# Altium project SAMA7D65-Curiosity.PrjPcb (part 12 of 12)
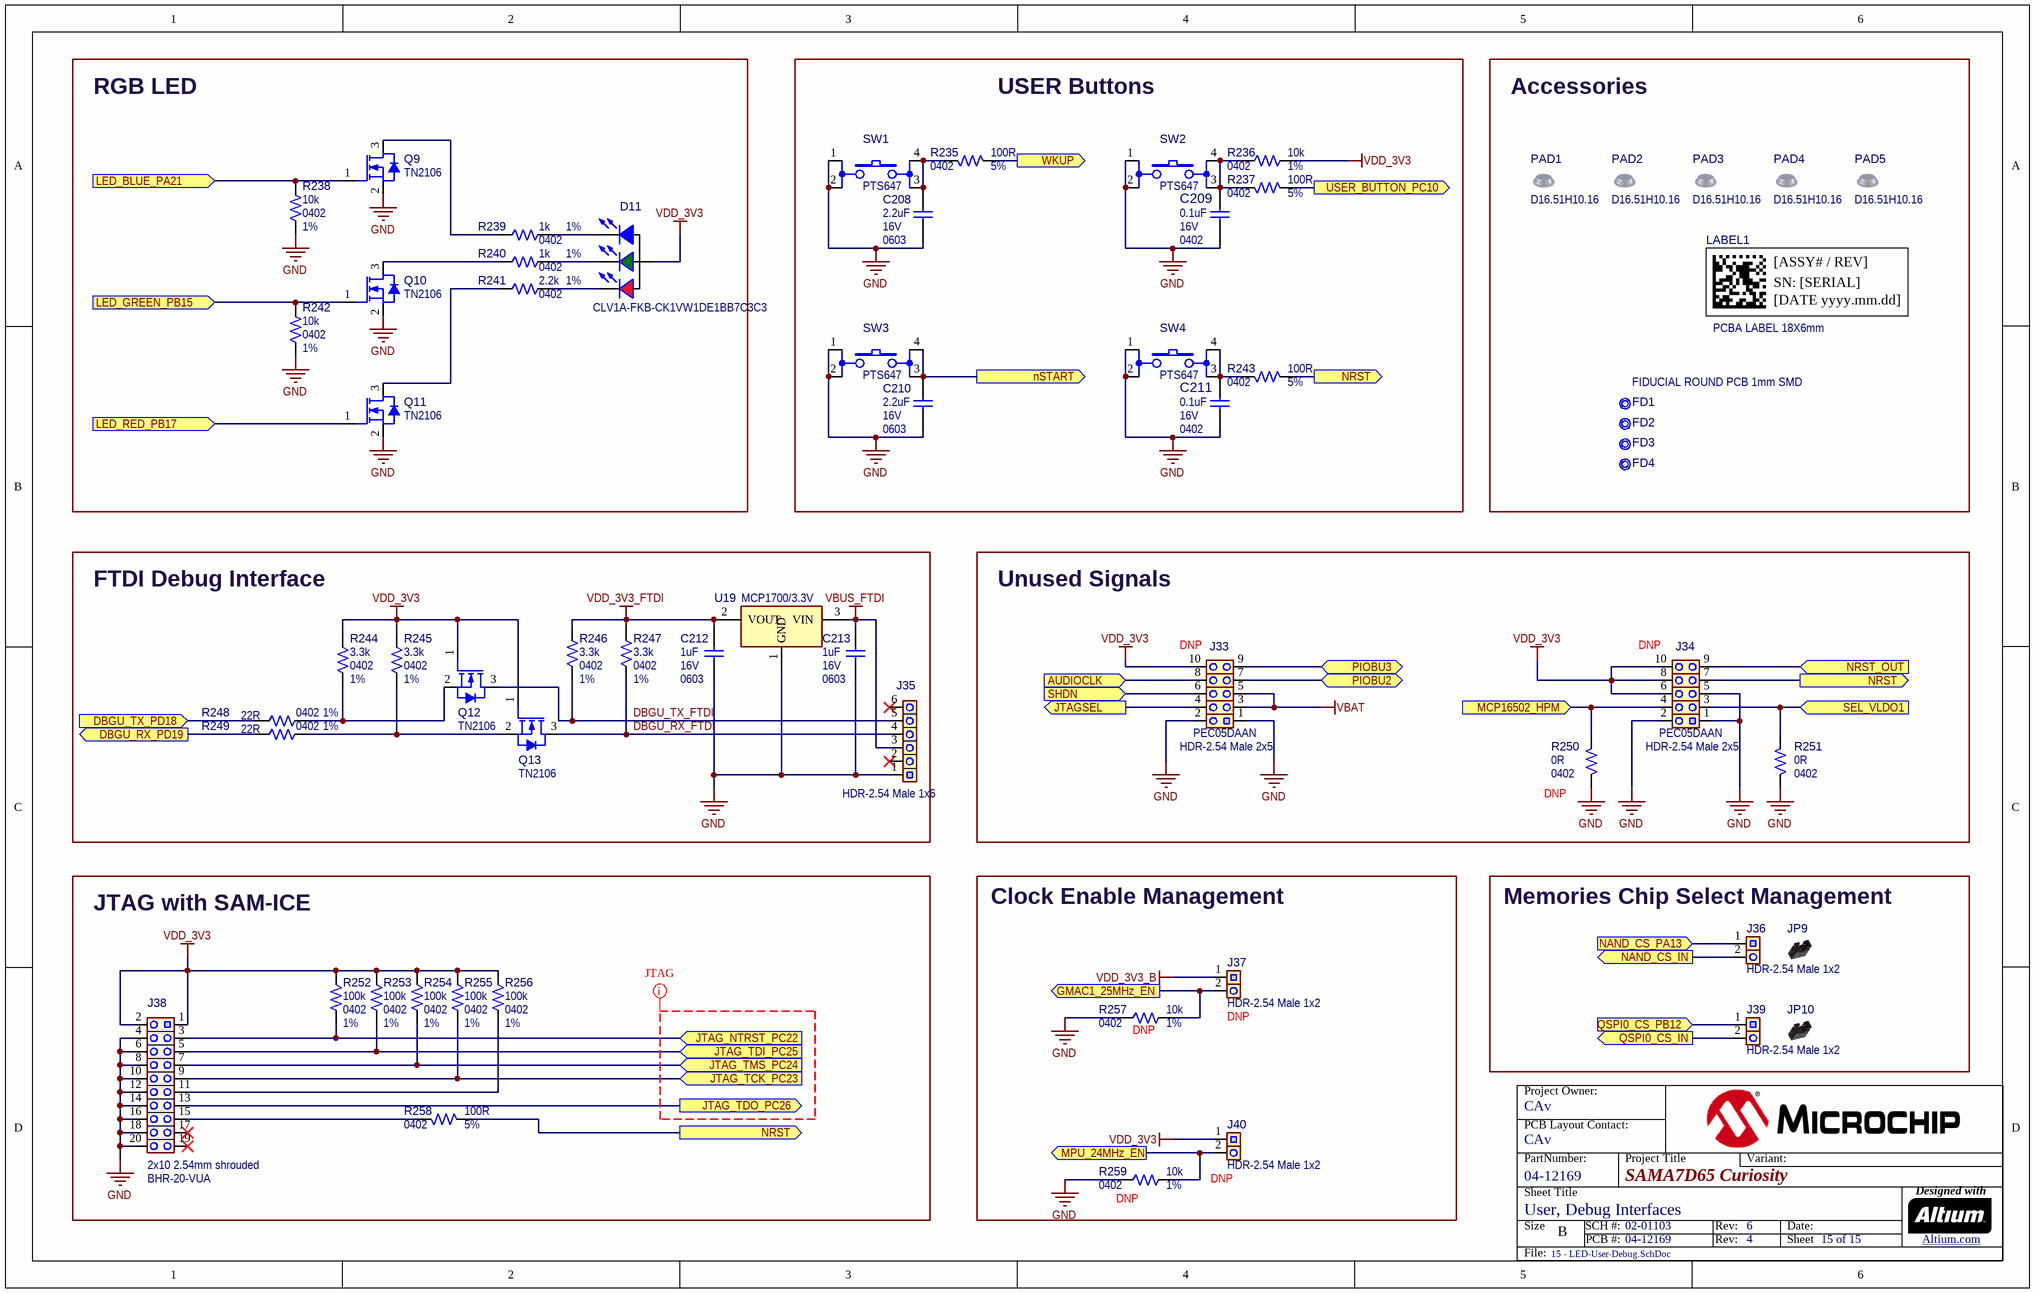
[diagram p15: 15 - LED-User-Debug.SchDoc]

## Nets that join several sheets
5V_MAIN: 03 - Power (17 pins), 04 - PMIC-PWR Monitor (12 pins), 08 - Memories (C128.1 U10.1 U10.2), 10 - GMAC0 (C146.2 U13.3), 11 - GMAC1-SODIMM (5 pins), 12 - MIPI-LVDS-RGB (8 pins), 13 - USB (C181.1 C182.1 U15.7), 14 - mBUS-CAN (12 pins)
GND: 03 - Power (39 pins), 04 - PMIC-PWR Monitor (32 pins), 05 - SAMA7D65-MPU (101 pins), 06 - SAMA7D65-DDR3L (81 pins), 08 - Memories (33 pins), 09 - M.2-SDMMC2 (27 pins), 10 - GMAC0 (43 pins), 11 - GMAC1-SODIMM (102 pins), 12 - MIPI-LVDS-RGB (63 pins), 13 - USB (11 pins), 14 - mBUS-CAN (38 pins), 15 - LED-User-Debug (39 pins)
VBAT: 03 - Power (J4.1), 04 - PMIC-PWR Monitor (R23.2), 05 - SAMA7D65-MPU (C74.1 U5.E8), 09 - M.2-SDMMC2 (R155.1), 11 - GMAC1-SODIMM (R202.2), 15 - LED-User-Debug (J33.3 J33.5)
VDD_2V5_B: 03 - Power (C10.1 L2.2 R8.1 U1.9), 11 - GMAC1-SODIMM (5 pins)
VDD_3V3: 03 - Power (D3.1 J2.1), 04 - PMIC-PWR Monitor (21 pins), 05 - SAMA7D65-MPU (22 pins), 07 - SAMA7D65-PIO (8 pins), 08 - Memories (25 pins), 09 - M.2-SDMMC2 (7 pins), 10 - GMAC0 (28 pins), 11 - GMAC1-SODIMM (R194.2 R195.2 R196.2 R197.1), 12 - MIPI-LVDS-RGB (J18.1 J18.17), 13 - USB (R216.2 R217.2), 14 - mBUS-CAN (18 pins), 15 - LED-User-Debug (18 pins)
VDD_3V3_B: 03 - Power (C5.1 L1.2 R2.1 U1.31), 09 - M.2-SDMMC2 (15 pins), 11 - GMAC1-SODIMM (8 pins), 15 - LED-User-Debug (J37.1)
VDDCORE: 04 - PMIC-PWR Monitor (R31.2 TP4.1 U3.25), 05 - SAMA7D65-MPU (30 pins)
VDDCPU: 04 - PMIC-PWR Monitor (R32.2 TP5.1 U3.32), 05 - SAMA7D65-MPU (11 pins)
VDDIODDR: 04 - PMIC-PWR Monitor (R30.2 TP3.1 U3.16), 06 - SAMA7D65-DDR3L (73 pins)
VDDSDMMC1: 05 - SAMA7D65-MPU (C59.1 U5.F9), 08 - Memories (8 pins)
AUDIOCLK: 05 - SAMA7D65-MPU (U5.K8), 15 - LED-User-Debug (J33.8)
BT_CTS_PD5: 07 - SAMA7D65-PIO (U5.A19), 09 - M.2-SDMMC2 (J11.34)
BT_RTS_PD3: 07 - SAMA7D65-PIO (U5.B18), 09 - M.2-SDMMC2 (J11.36)
BT_RXD_PD6: 07 - SAMA7D65-PIO (U5.G10), 09 - M.2-SDMMC2 (J11.22 R158.1)
BT_TXD_PD7: 07 - SAMA7D65-PIO (U5.A20), 09 - M.2-SDMMC2 (J11.32 R159.1)
CAN1_RX_PD11: 07 - SAMA7D65-PIO (U5.H11), 14 - mBUS-CAN (C200.2 U16.4)
CAN1_TX_PD10: 07 - SAMA7D65-PIO (U5.G16), 14 - mBUS-CAN (U16.1)
CAN2_RX_PD13: 07 - SAMA7D65-PIO (U5.J11), 14 - mBUS-CAN (C207.2 U18.4)
CAN2_TX_PD12: 07 - SAMA7D65-PIO (U5.D18), 14 - mBUS-CAN (U18.1)
CAN3_RX_PD15: 07 - SAMA7D65-PIO (U5.H12), 14 - mBUS-CAN (C203.2 U17.4)
CAN3_TX_PD14: 07 - SAMA7D65-PIO (U5.C18), 14 - mBUS-CAN (U17.1)
COEX_PTA_BT-ACTIVE: 09 - M.2-SDMMC2 (J11.48), 14 - mBUS-CAN (J27.1 J28.1)
COEX_PTA_BT-PRIORITY: 09 - M.2-SDMMC2 (J11.44), 14 - mBUS-CAN (J27.2 J28.2)
COEX_PTA_WLAN-ACTIVE: 09 - M.2-SDMMC2 (J11.46), 14 - mBUS-CAN (J27.3 J28.3)
DBGU_RX_PD19: 04 - PMIC-PWR Monitor (R18.1), 07 - SAMA7D65-PIO (U5.F18), 15 - LED-User-Debug (R249.1)
DBGU_TX_PD18: 04 - PMIC-PWR Monitor (R16.1), 07 - SAMA7D65-PIO (U5.H16), 15 - LED-User-Debug (R248.1)
EEPROM_TWCK_PB19: 07 - SAMA7D65-PIO (R81.2), 08 - Memories (U7.1)
EEPROM_TWD_PB20: 07 - SAMA7D65-PIO (R91.2), 08 - Memories (U7.3)
GMAC0_INT_PC1: 07 - SAMA7D65-PIO (U5.C8), 10 - GMAC0 (R166.1 U14.39)
GMAC0_MDC_PA31: 07 - SAMA7D65-PIO (U5.F21), 10 - GMAC0 (U14.37)
GMAC0_MDIO_PB0: 07 - SAMA7D65-PIO (U5.M10), 10 - GMAC0 (R167.1 U14.38)
GMAC0_RX0_PA29: 07 - SAMA7D65-PIO (U5.D21), 10 - GMAC0 (R173.2)
GMAC0_RX1_PA30: 07 - SAMA7D65-PIO (U5.K15), 10 - GMAC0 (R174.2)
GMAC0_RX2_PB2: 07 - SAMA7D65-PIO (U5.J14), 10 - GMAC0 (R175.2)
GMAC0_RX3_PB6: 07 - SAMA7D65-PIO (U5.K13), 10 - GMAC0 (R176.2)
GMAC0_RXCK_PB3: 07 - SAMA7D65-PIO (U5.J21), 10 - GMAC0 (C162.2 R177.2)
GMAC0_RXCTL_PA28: 07 - SAMA7D65-PIO (U5.L13), 10 - GMAC0 (R178.2)
GMAC0_TX0_PA26: 07 - SAMA7D65-PIO (U5.K14), 10 - GMAC0 (U14.19)
GMAC0_TX1_PA27: 07 - SAMA7D65-PIO (U5.C21), 10 - GMAC0 (U14.20)
GMAC0_TX2_PB4: 07 - SAMA7D65-PIO (U5.J15), 10 - GMAC0 (U14.21)
GMAC0_TX3_PB5: 07 - SAMA7D65-PIO (U5.J20), 10 - GMAC0 (U14.22)
GMAC0_TXCK_PB1: 07 - SAMA7D65-PIO (U5.G21), 10 - GMAC0 (C165.2 U14.25)
GMAC0_TXCTL_PA25: 07 - SAMA7D65-PIO (U5.B21), 10 - GMAC0 (U14.26)
GMAC1_25MHz_EN: 11 - GMAC1-SODIMM (Y6.1), 15 - LED-User-Debug (J37.2 R257.1)
GMAC1_IRQ_PE3: 07 - SAMA7D65-PIO (U5.D20), 11 - GMAC1-SODIMM (D7.1 R196.1)
GMAC1_MDC_PD25: 07 - SAMA7D65-PIO (U5.K9), 11 - GMAC1-SODIMM (J15.45 R194.1)
GMAC1_MDIO_PD26: 07 - SAMA7D65-PIO (U5.D19), 11 - GMAC1-SODIMM (J15.47 R195.1)
GMAC1_MISO_PA17: 07 - SAMA7D65-PIO (R57.2), 11 - GMAC1-SODIMM (J15.31)
GMAC1_MOSI_PA18: 07 - SAMA7D65-PIO (R53.2), 11 - GMAC1-SODIMM (J15.33)
GMAC1_RX0_PD27: 07 - SAMA7D65-PIO (U5.K10), 11 - GMAC1-SODIMM (J15.125)
GMAC1_RX1_PD28: 07 - SAMA7D65-PIO (U5.C19), 11 - GMAC1-SODIMM (J15.129)
GMAC1_RX2_PD30: 07 - SAMA7D65-PIO (U5.B19), 11 - GMAC1-SODIMM (J15.133)
GMAC1_RX3_PD31: 07 - SAMA7D65-PIO (U5.F20), 11 - GMAC1-SODIMM (J15.137)
GMAC1_RXCK_PE2: 07 - SAMA7D65-PIO (U5.K12), 11 - GMAC1-SODIMM (C173.2 J15.121)
GMAC1_RXCTL_PD24: 07 - SAMA7D65-PIO (U5.G19), 11 - GMAC1-SODIMM (J15.117)
GMAC1_SPCK_PA16: 07 - SAMA7D65-PIO (R61.2), 11 - GMAC1-SODIMM (J15.35)
GMAC1_SPI_CS_PA20: 07 - SAMA7D65-PIO (R71.2), 11 - GMAC1-SODIMM (J15.38)
GMAC1_TWCK_PB19: 07 - SAMA7D65-PIO (R84.2), 11 - GMAC1-SODIMM (J15.39)
GMAC1_TWD_PB20: 07 - SAMA7D65-PIO (R92.2), 11 - GMAC1-SODIMM (J15.41)
GMAC1_TX0_PD22: 07 - SAMA7D65-PIO (U5.F19), 11 - GMAC1-SODIMM (R205.1)
GMAC1_TX1_PD23: 07 - SAMA7D65-PIO (U5.G18), 11 - GMAC1-SODIMM (R206.1)
GMAC1_TX2_PE0: 07 - SAMA7D65-PIO (U5.H17), 11 - GMAC1-SODIMM (R207.1)
GMAC1_TX3_PE1: 07 - SAMA7D65-PIO (U5.G20), 11 - GMAC1-SODIMM (R208.1)
GMAC1_TXCK_PD29: 07 - SAMA7D65-PIO (U5.H18), 11 - GMAC1-SODIMM (C172.2 R204.1)
GMAC1_TXEN_PD21: 07 - SAMA7D65-PIO (U5.H15), 11 - GMAC1-SODIMM (R203.1)
HHSA_CC1_PB31: 03 - Power (Q6.2 R11.1), 07 - SAMA7D65-PIO (R116.1)
HHSA_CC2_PC0: 03 - Power (Q7.2 R12.1), 07 - SAMA7D65-PIO (R121.1)
JTAG_NTRST_PC22: 07 - SAMA7D65-PIO (U5.F4), 15 - LED-User-Debug (J38.3 R252.1)
JTAG_TCK_PC23: 07 - SAMA7D65-PIO (U5.A3), 15 - LED-User-Debug (J38.9 R255.1)
JTAG_TDI_PC25: 07 - SAMA7D65-PIO (U5.B3), 15 - LED-User-Debug (J38.5 R253.1)
JTAG_TDO_PC26: 07 - SAMA7D65-PIO (U5.G6), 15 - LED-User-Debug (J38.13)
JTAG_TMS_PC24: 07 - SAMA7D65-PIO (U5.F5), 15 - LED-User-Debug (J38.7 R254.1)
JTAGSEL: 05 - SAMA7D65-MPU (R35.1 U5.H10), 15 - LED-User-Debug (J33.4)
LCD_LVDS_CK_N: 07 - SAMA7D65-PIO (U5.AA18), 12 - MIPI-LVDS-RGB (J17.23)
LCD_LVDS_CK_P: 07 - SAMA7D65-PIO (U5.Y18), 12 - MIPI-LVDS-RGB (J17.22)
LCD_LVDS_D0_N: 07 - SAMA7D65-PIO (U5.AA13), 12 - MIPI-LVDS-RGB (J17.29)
LCD_LVDS_D0_P: 07 - SAMA7D65-PIO (U5.Y13), 12 - MIPI-LVDS-RGB (J17.28)
LCD_LVDS_D1_N: 07 - SAMA7D65-PIO (U5.AA15), 12 - MIPI-LVDS-RGB (J17.26)
LCD_LVDS_D1_P: 07 - SAMA7D65-PIO (U5.Y15), 12 - MIPI-LVDS-RGB (J17.25)
LCD_LVDS_D2_N: 07 - SAMA7D65-PIO (U5.AA16), 12 - MIPI-LVDS-RGB (J17.20)
LCD_LVDS_D2_P: 07 - SAMA7D65-PIO (U5.Y16), 12 - MIPI-LVDS-RGB (J17.19)
LCD_LVDS_D3_N: 07 - SAMA7D65-PIO (U5.AA19), 12 - MIPI-LVDS-RGB (J17.17)
LCD_LVDS_D3_P: 07 - SAMA7D65-PIO (U5.Y19), 12 - MIPI-LVDS-RGB (J17.16)
LED_BLUE_PA21: 07 - SAMA7D65-PIO (U5.W19), 15 - LED-User-Debug (Q9.1 R238.1)
LED_GREEN_PB15: 07 - SAMA7D65-PIO (R78.2), 15 - LED-User-Debug (Q10.1 R242.1)
LED_RED_PB17: 07 - SAMA7D65-PIO (R86.2), 15 - LED-User-Debug (Q11.1)
LPM: 04 - PMIC-PWR Monitor (TP1.1 U3.22), 05 - SAMA7D65-MPU (U5.A6)
LVDS_ENABLE_PB18: 07 - SAMA7D65-PIO (R76.2), 12 - MIPI-LVDS-RGB (R211.2 R213.2)
LVDS_IRQ_PB16: 07 - SAMA7D65-PIO (R74.2), 12 - MIPI-LVDS-RGB (J17.13)
LVDS_PWM_PB14: 07 - SAMA7D65-PIO (R69.2), 12 - MIPI-LVDS-RGB (J17.14)
LVDS_TWCK_PC6: 07 - SAMA7D65-PIO (R98.2), 12 - MIPI-LVDS-RGB (J17.11)
LVDS_TWD_PC7: 07 - SAMA7D65-PIO (R111.2), 12 - MIPI-LVDS-RGB (J17.10)
MBUS1_AN_PC5: 07 - SAMA7D65-PIO (U5.G3), 14 - mBUS-CAN (J25.1)
MBUS1_INT_PB7: 07 - SAMA7D65-PIO (U5.C20), 14 - mBUS-CAN (J25.15 R220.1)
MBUS1_MISO_PA17: 07 - SAMA7D65-PIO (R54.2), 14 - mBUS-CAN (J25.5)
MBUS1_MOSI_PA18: 07 - SAMA7D65-PIO (R50.2), 14 - mBUS-CAN (J25.6)
MBUS1_PWM_PB15: 07 - SAMA7D65-PIO (R80.2), 14 - mBUS-CAN (J25.16)
MBUS1_RX/CAN0_RX_PD9: 07 - SAMA7D65-PIO (U5.F14), 14 - mBUS-CAN (J25.14)
MBUS1_SCK_PA16: 07 - SAMA7D65-PIO (R58.2), 14 - mBUS-CAN (J25.4)
MBUS1_SPI_CS_PA15: 07 - SAMA7D65-PIO (R62.2), 14 - mBUS-CAN (J25.3)
MBUS1_TWCK_PC6: 07 - SAMA7D65-PIO (R101.2), 14 - mBUS-CAN (J25.12)
MBUS1_TWD_PC7: 07 - SAMA7D65-PIO (R115.2), 14 - mBUS-CAN (J25.11)
MBUS1_TX/CAN0_TX_PD8: 07 - SAMA7D65-PIO (U5.G14), 14 - mBUS-CAN (J25.13)
MBUS2_AN_PC13: 07 - SAMA7D65-PIO (U5.D1), 14 - mBUS-CAN (J26.1)
MBUS2_INT_PA22: 07 - SAMA7D65-PIO (U5.P10), 14 - mBUS-CAN (J26.15 R221.1)
MBUS2_MISO_PA17: 07 - SAMA7D65-PIO (R55.2), 14 - mBUS-CAN (J26.5)
MBUS2_MOSI_PA18: 07 - SAMA7D65-PIO (R51.2), 14 - mBUS-CAN (J26.6)
MBUS2_PWM_PB17: 07 - SAMA7D65-PIO (R88.2), 14 - mBUS-CAN (J26.16)
MBUS2_RX/CAN4_RX_PD17: 07 - SAMA7D65-PIO (U5.H13), 14 - mBUS-CAN (J26.14)
MBUS2_SCK_PA16: 07 - SAMA7D65-PIO (R59.2), 14 - mBUS-CAN (J26.4)
MBUS2_SPI_CS_PA14: 07 - SAMA7D65-PIO (R64.2), 14 - mBUS-CAN (J26.3)
MBUS2_TWCK_PC6: 07 - SAMA7D65-PIO (R103.2), 14 - mBUS-CAN (J26.12)
MBUS2_TWD_PC7: 07 - SAMA7D65-PIO (R117.2), 14 - mBUS-CAN (J26.11)
MBUS2_TX/CAN4_TX_PD16: 07 - SAMA7D65-PIO (U5.E18), 14 - mBUS-CAN (J26.13)
MBUS_nRST_PC9: 07 - SAMA7D65-PIO (U5.D6), 14 - mBUS-CAN (R224.1 R225.1)
MCP16502_HPM: 04 - PMIC-PWR Monitor (R19.1), 15 - LED-User-Debug (J34.4 R250.2)
MCP16502_INT_PC2: 04 - PMIC-PWR Monitor (R25.1 U3.1), 07 - SAMA7D65-PIO (U5.D7)
MCP16502_TWCK_PB19: 04 - PMIC-PWR Monitor (U3.6), 07 - SAMA7D65-PIO (R77.2)
MCP16502_TWD_PB20: 04 - PMIC-PWR Monitor (U3.5), 07 - SAMA7D65-PIO (R87.2)
MIPI_CK_N: 05 - SAMA7D65-MPU (U5.V20), 12 - MIPI-LVDS-RGB (J16.27)
MIPI_CK_P: 05 - SAMA7D65-MPU (U5.V21), 12 - MIPI-LVDS-RGB (J16.26)
MIPI_D0_N: 05 - SAMA7D65-MPU (U5.Y20), 12 - MIPI-LVDS-RGB (J16.33)
MIPI_D0_P: 05 - SAMA7D65-MPU (U5.Y21), 12 - MIPI-LVDS-RGB (J16.32)
MIPI_D1_N: 05 - SAMA7D65-MPU (U5.W20), 12 - MIPI-LVDS-RGB (J16.30)
MIPI_D1_P: 05 - SAMA7D65-MPU (U5.W21), 12 - MIPI-LVDS-RGB (J16.29)
MIPI_D2_N: 05 - SAMA7D65-MPU (U5.T20), 12 - MIPI-LVDS-RGB (J16.24)
MIPI_D2_P: 05 - SAMA7D65-MPU (U5.T21), 12 - MIPI-LVDS-RGB (J16.23)
MIPI_D3_N: 05 - SAMA7D65-MPU (U5.R20), 12 - MIPI-LVDS-RGB (J16.21)
MIPI_D3_P: 05 - SAMA7D65-MPU (U5.R21), 12 - MIPI-LVDS-RGB (J16.20)
MIPI_ENABLE_PB18: 07 - SAMA7D65-PIO (R75.2), 12 - MIPI-LVDS-RGB (R210.2 R212.2)
MIPI_IRQ_PB16: 07 - SAMA7D65-PIO (R72.2), 12 - MIPI-LVDS-RGB (J16.13)
MIPI_PWM_PB14: 07 - SAMA7D65-PIO (R67.2), 12 - MIPI-LVDS-RGB (J16.16)
MIPI_TWCK_PC6: 07 - SAMA7D65-PIO (R100.2), 12 - MIPI-LVDS-RGB (J16.11)
MIPI_TWD_PC7: 07 - SAMA7D65-PIO (R113.2), 12 - MIPI-LVDS-RGB (J16.10)
MPU_24MHz_EN: 05 - SAMA7D65-MPU (Y2.1), 15 - LED-User-Debug (J40.2 R259.1)
NAND_ALE_PA1: 07 - SAMA7D65-PIO (U5.V17), 08 - Memories (U8.C4)
NAND_CLE_PA2: 07 - SAMA7D65-PIO (U5.R14), 08 - Memories (U8.D5)
NAND_CS_IN: 08 - Memories (R130.1 U8.C6), 15 - LED-User-Debug (J36.2)
NAND_CS_PA13: 07 - SAMA7D65-PIO (U5.P11), 15 - LED-User-Debug (J36.1)
NAND_D0_PA3: 07 - SAMA7D65-PIO (U5.T18), 08 - Memories (U8.H4)
NAND_D1_PA4: 07 - SAMA7D65-PIO (U5.P16), 08 - Memories (U8.J4)
NAND_D2_PA9: 07 - SAMA7D65-PIO (U5.U14), 08 - Memories (U8.K4)
NAND_D3_PA10: 07 - SAMA7D65-PIO (U5.R12), 08 - Memories (U8.K5)
NAND_D4_PA5: 07 - SAMA7D65-PIO (U5.V16), 08 - Memories (U8.K6)
NAND_D5_PA6: 07 - SAMA7D65-PIO (U5.T14), 08 - Memories (U8.J7)
NAND_D6_PA7: 07 - SAMA7D65-PIO (U5.P15), 08 - Memories (U8.K7)
NAND_D7_PA8: 07 - SAMA7D65-PIO (U5.R13), 08 - Memories (U8.J8)
NAND_RDY_PA11: 07 - SAMA7D65-PIO (U5.P12), 08 - Memories (R131.1 U8.C8)
NAND_RE_PA12: 07 - SAMA7D65-PIO (U5.W15), 08 - Memories (U8.D4)
NAND_WE_PA0: 07 - SAMA7D65-PIO (U5.U18), 08 - Memories (U8.C7)
NRST: 04 - PMIC-PWR Monitor (R24.1 U3.2), 05 - SAMA7D65-MPU (U5.D3), 10 - GMAC0 (R184.2), 11 - GMAC1-SODIMM (R200.2), 12 - MIPI-LVDS-RGB (D8.3), 14 - mBUS-CAN (R222.1), 15 - LED-User-Debug (J34.7 R243.2 R258.2)
nRST_OUT: 05 - SAMA7D65-MPU (R34.2 U5.E4), 08 - Memories (D5.2), 10 - GMAC0 (R185.2), 11 - GMAC1-SODIMM (R201.2), 14 - mBUS-CAN (R223.1), 15 - LED-User-Debug (J34.9)
nSTART: 04 - PMIC-PWR Monitor (U3.24), 15 - LED-User-Debug (C210.2 SW3.3 SW3.4)
PAC1934_INT_PB31: 04 - PMIC-PWR Monitor (R27.1 U4.1), 07 - SAMA7D65-PIO (R112.2)
PAC1934_TWCK_PB19: 04 - PMIC-PWR Monitor (J6.3), 07 - SAMA7D65-PIO (R79.2)
PAC1934_TWD_PB20: 04 - PMIC-PWR Monitor (J7.3), 07 - SAMA7D65-PIO (R89.2)
PIOBU0_WAKE: 07 - SAMA7D65-PIO (U5.J10), 09 - M.2-SDMMC2 (D6.2 R155.2)
PIOBU1_WAKE: 07 - SAMA7D65-PIO (U5.A5), 11 - GMAC1-SODIMM (D7.2 R202.1)
PIOBU2: 07 - SAMA7D65-PIO (U5.D8), 15 - LED-User-Debug (J33.7)
PIOBU3: 07 - SAMA7D65-PIO (U5.A4), 15 - LED-User-Debug (J33.9)
QSPI0_CS_IN: 08 - Memories (R132.1 U9.1), 15 - LED-User-Debug (J39.2)
QSPI0_CS_PB12: 07 - SAMA7D65-PIO (U5.P18), 15 - LED-User-Debug (J39.1)
QSPI0_IO0_PB11: 07 - SAMA7D65-PIO (U5.R19), 08 - Memories (U9.5)
QSPI0_IO1_PB10: 07 - SAMA7D65-PIO (U5.P17), 08 - Memories (U9.2)
QSPI0_IO2_PB9: 07 - SAMA7D65-PIO (U5.R18), 08 - Memories (R134.1 U9.3)
QSPI0_IO3_PB8: 07 - SAMA7D65-PIO (U5.T19), 08 - Memories (R133.1 U9.7)
QSPI0_SCK_PB13: 07 - SAMA7D65-PIO (U5.N14), 08 - Memories (C126.2 U9.6)
RPI_GPCLK0_PB31: 07 - SAMA7D65-PIO (R114.2), 12 - MIPI-LVDS-RGB (J18.7)
RPI_GPCLK1_PD20: 07 - SAMA7D65-PIO (R127.2), 12 - MIPI-LVDS-RGB (J18.29)
RPI_GPCLK2_PC0: 07 - SAMA7D65-PIO (R119.2), 12 - MIPI-LVDS-RGB (J18.31)
RPI_GPIO16_PC18: 07 - SAMA7D65-PIO (R104.2), 12 - MIPI-LVDS-RGB (J18.36)
RPI_GPIO17_PC3: 07 - SAMA7D65-PIO (U5.G8), 12 - MIPI-LVDS-RGB (J18.11)
RPI_GPIO22_PD1: 07 - SAMA7D65-PIO (R123.2), 12 - MIPI-LVDS-RGB (J18.15)
RPI_GPIO23_PD2: 07 - SAMA7D65-PIO (R125.2), 12 - MIPI-LVDS-RGB (J18.16)
RPI_GPIO24_PC12: 07 - SAMA7D65-PIO (U5.H5), 12 - MIPI-LVDS-RGB (J18.18)
RPI_GPIO25_PC11: 07 - SAMA7D65-PIO (U5.C1), 12 - MIPI-LVDS-RGB (J18.22)
RPI_GPIO26_PC19: 07 - SAMA7D65-PIO (R109.2), 12 - MIPI-LVDS-RGB (J18.37)
RPI_GPIO27_PC4: 07 - SAMA7D65-PIO (U5.C2), 12 - MIPI-LVDS-RGB (J18.13)
RPI_I2S_CK_PC16: 07 - SAMA7D65-PIO (U5.H4), 12 - MIPI-LVDS-RGB (J18.12)
RPI_I2S_DIN0_PC14: 07 - SAMA7D65-PIO (U5.J7), 12 - MIPI-LVDS-RGB (J18.38)
RPI_I2S_DOUT0_PC17: 07 - SAMA7D65-PIO (U5.D4), 12 - MIPI-LVDS-RGB (J18.40)
RPI_I2S_WS_PC15: 07 - SAMA7D65-PIO (U5.F3), 12 - MIPI-LVDS-RGB (J18.35)
RPI_MISO_PA17: 07 - SAMA7D65-PIO (R56.2), 12 - MIPI-LVDS-RGB (J18.21)
RPI_MOSI_PA18: 07 - SAMA7D65-PIO (R52.2), 12 - MIPI-LVDS-RGB (J18.19)
RPI_NPCS0_PA19: 07 - SAMA7D65-PIO (R66.2), 12 - MIPI-LVDS-RGB (J18.24)
RPI_NPCS1_PA20: 07 - SAMA7D65-PIO (R70.2), 12 - MIPI-LVDS-RGB (J18.26)
RPI_PWM0_PB15: 07 - SAMA7D65-PIO (R82.2), 12 - MIPI-LVDS-RGB (J18.32)
RPI_PWM1_PB17: 07 - SAMA7D65-PIO (R90.2), 12 - MIPI-LVDS-RGB (J18.33)
RPI_RXD_PA23: 07 - SAMA7D65-PIO (U5.AA20), 12 - MIPI-LVDS-RGB (J18.10)
RPI_SPCK_PA16: 07 - SAMA7D65-PIO (R60.2), 12 - MIPI-LVDS-RGB (J18.23)
RPI_TWCK_PC6: 07 - SAMA7D65-PIO (R105.2), 12 - MIPI-LVDS-RGB (J18.5)
RPI_TWD_PC7: 07 - SAMA7D65-PIO (R118.2), 12 - MIPI-LVDS-RGB (J18.3)
RPI_TXD_PA24: 07 - SAMA7D65-PIO (U5.P9), 12 - MIPI-LVDS-RGB (J18.8)
SDMMC1_1V8SEL_PB30: 07 - SAMA7D65-PIO (U5.A2), 08 - Memories (Q8.1 R136.1 R138.2)
SDMMC1_CD_PB29: 07 - SAMA7D65-PIO (U5.G4), 08 - Memories (J10.10 R145.1)
SDMMC1_CK_PB23: 07 - SAMA7D65-PIO (U5.D14), 08 - Memories (C130.2 J10.5)
SDMMC1_CMD_PB22: 07 - SAMA7D65-PIO (U5.C14), 08 - Memories (J10.2 R140.2)
SDMMC1_DAT0_PB24: 07 - SAMA7D65-PIO (U5.B15), 08 - Memories (J10.7 R141.2)
SDMMC1_DAT1_PB25: 07 - SAMA7D65-PIO (U5.A13), 08 - Memories (J10.8 R142.2)
SDMMC1_DAT2_PB26: 07 - SAMA7D65-PIO (U5.A15), 08 - Memories (J10.9 R143.2)
SDMMC1_DAT3_PB27: 07 - SAMA7D65-PIO (U5.C11), 08 - Memories (J10.1 R144.2)
SDMMC1_NRST_PB21: 07 - SAMA7D65-PIO (U5.D15), 08 - Memories (D5.1)
SDMMC1_WP_PB28: 07 - SAMA7D65-PIO (U5.C3), 08 - Memories (J10.11 R146.1)
SDMMC2_CK_PC28: 07 - SAMA7D65-PIO (R95.2), 09 - M.2-SDMMC2 (C134.2 J11.9)
SDMMC2_CMD_PC27: 07 - SAMA7D65-PIO (R93.2), 09 - M.2-SDMMC2 (R148.2 U12.2)
SDMMC2_DAT0_PC29: 07 - SAMA7D65-PIO (R97.2), 09 - M.2-SDMMC2 (R149.2 U12.5)
SDMMC2_DAT1_PC30: 07 - SAMA7D65-PIO (U5.D17), 09 - M.2-SDMMC2 (J11.15 R150.2)
SDMMC2_DAT2_PC31: 07 - SAMA7D65-PIO (U5.A16), 09 - M.2-SDMMC2 (R151.2 U12.11)
SDMMC2_DAT3_PD0: 07 - SAMA7D65-PIO (U5.C16), 09 - M.2-SDMMC2 (J11.19 R152.2)
SEL_VLDO1: 04 - PMIC-PWR Monitor (U3.18), 15 - LED-User-Debug (J34.3 R251.2)
SHDN: 04 - PMIC-PWR Monitor (R20.1), 05 - SAMA7D65-MPU (U5.B4), 15 - LED-User-Debug (J33.6)
USBA_N: 03 - Power (D2.7), 05 - SAMA7D65-MPU (U5.F1)
USBA_P: 03 - Power (D2.6), 05 - SAMA7D65-MPU (U5.F2)
USBA_VBUS_DETECT_PC8: 03 - Power (R13.2 R14.2), 07 - SAMA7D65-PIO (U5.E6)
USBB_EN_5V_PC20: 07 - SAMA7D65-PIO (U5.C6), 13 - USB (R218.2 U15.1)
USBB_N: 05 - SAMA7D65-MPU (U5.G1), 13 - USB (D9.7)
USBB_OVCUR_PC18: 07 - SAMA7D65-PIO (R102.2), 13 - USB (R216.1 U15.2)
USBB_P: 05 - SAMA7D65-MPU (U5.G2), 13 - USB (D9.6)
USBC_EN_5V_PC21: 07 - SAMA7D65-PIO (U5.F8), 13 - USB (R219.2 U15.4)
USBC_N: 05 - SAMA7D65-MPU (U5.J1), 13 - USB (D10.7)
USBC_OVCUR_PC19: 07 - SAMA7D65-PIO (R108.2), 13 - USB (R217.1 U15.3)
USBC_P: 05 - SAMA7D65-MPU (U5.J2), 13 - USB (D10.6)
USER_BUTTON_PC10: 07 - SAMA7D65-PIO (U5.H7), 15 - LED-User-Debug (R237.2)
WIFI_IRQN_PD1: 07 - SAMA7D65-PIO (R122.2), 09 - M.2-SDMMC2 (J11.40)
WIFI_RSTN_PD20: 07 - SAMA7D65-PIO (R126.2), 09 - M.2-SDMMC2 (J11.54)
WIFI_SPI_MISO_PC28: 07 - SAMA7D65-PIO (R96.2), 09 - M.2-SDMMC2 (U12.6)
WIFI_SPI_MOSI_PC27: 07 - SAMA7D65-PIO (R94.2), 09 - M.2-SDMMC2 (U12.10)
WIFI_SPI_SCK_PC29: 07 - SAMA7D65-PIO (R99.2), 09 - M.2-SDMMC2 (U12.3)
WIFI_TWCK_PC6: 07 - SAMA7D65-PIO (R107.2), 09 - M.2-SDMMC2 (J11.60)
WIFI_TWD_PC7: 07 - SAMA7D65-PIO (R120.2), 09 - M.2-SDMMC2 (J11.58)
WIFI_TWI_IRQ_PD2: 07 - SAMA7D65-PIO (R124.2), 09 - M.2-SDMMC2 (J11.62 R157.1)
WIFI_WAKE_HOST_PD4: 07 - SAMA7D65-PIO (U5.G12), 09 - M.2-SDMMC2 (D6.1 R156.2)
WKUP: 04 - PMIC-PWR Monitor (R23.1 U3.7), 05 - SAMA7D65-MPU (U5.A8), 15 - LED-User-Debug (R235.2)

## Assembly variants
Standard: not fitted C75 C126 C130 C134 C162 C165 C172 C173 C174 C175 FB4 FB5 FB6 FB10 FB11 FB12 FB13 FB14 J8 J9 J13 J33 J34 J37 J40 R11 R12 R16 R18 R43 R44 R104 R109 R114 R116 R121 R123 R125 R127 R136 R171 R172 R184 R191 R192 R193 R194 R200 R209 R222 R223 R250 R257 R259 STANDOFF2 STANDOFF3 Y2 Y6